# Altium schematic sheet Power.SchDoc
size A
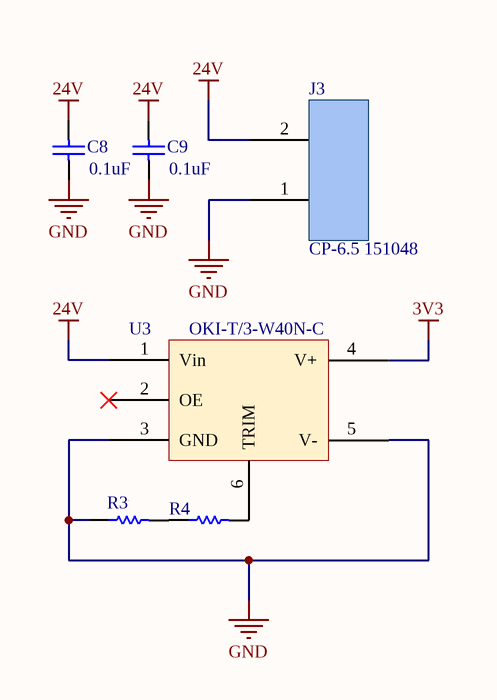
[diagram p0: Power.SchDoc]

## Parts
C8  value 0.1uF  [CAPC3216X100X50LL20T25]  (hidden comment: C1206F104K3RACTU)
C9  value 0.1uF  [CAPC3216X100X50LL20T25]  (hidden comment: C1206F104K3RACTU)
J3  CP-6.5 151048
R3  RES SMD 6.2K OHM 5% 1/4W 1206  [RESC1206(3216)_L]  (value not drawn)
R4  RES SMD 6.2K OHM 5% 1/4W 1206  [RESC1206(3216)_L]  (value not drawn)
U3  OKI-T/3-W40N-C

## Nets
3V3: U3.4(V+)
24V: C8.1 C9.1 J3.2 U3.1(Vin)
GND: C8.2 C9.2 J3.1 R3.1 U3.3(GND) U3.5(V-)
NetR3_2: R3.2 R4.1
NetR4_2: R4.2 U3.6(TRIM)

Not connected (* = marked no-connect by the designer): U3 2(OE)*

## Library data of the parts
C8 C9 = CMP-1664-00001-1: CAP CER 0.1UF 25V 10% X7R 1206; PackageReference: 1206; PartNumber: C1206F104K3RACTU; ComponentLink1URL: http://www.kemet.com/docfinder?Partnumber=C1206F104K3RACTU; ComponentLink1Description: Datasheet
J3 = CP-6.5 151048: Connector Header Through Hole 2 position
R3 = CMP-1014-00659-1: Tolerance: 0.5%; Power: 0.25 W; Value: 6200; Case-EIA: 1206; Case-Metric: 3216; Technology: SMT
R4 = CMP-1014-00659-1: RES SMD 1.54K OHM 0.1% 1/4W 1206; Tolerance: 0.5%; Power: 0.25 W; Value: 6200; Case-EIA: 1206; Case-Metric: 3216; Technology: SMT